# Altium schematic sheet Analog Front End.SchDoc
size A; SheetNumber: 2; SheetTotal: 5
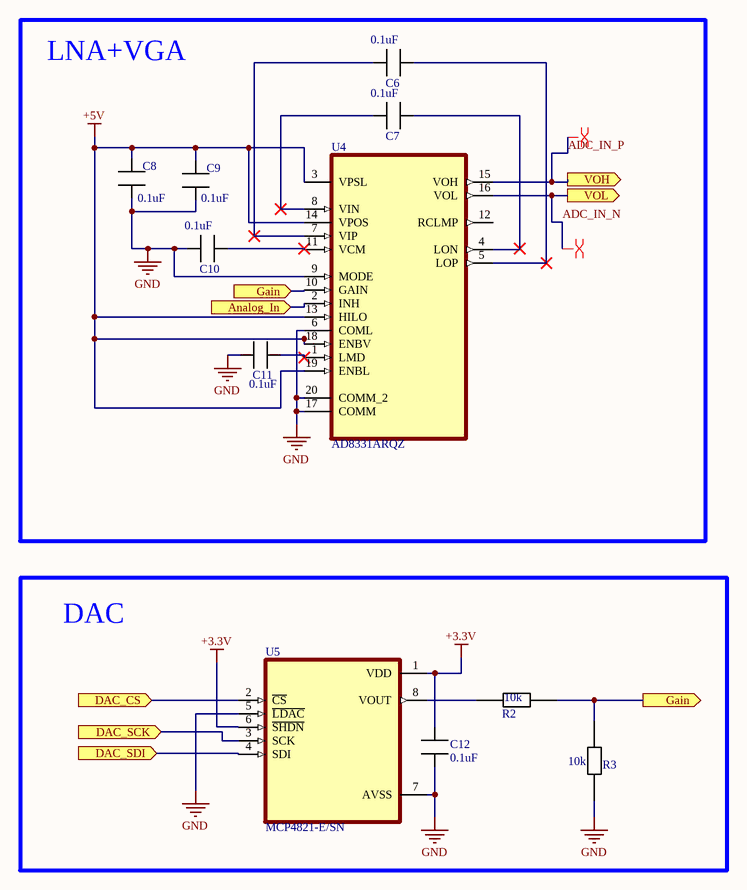
[diagram p0: Analog Front End.SchDoc]

## Parts
C6  0.1uF  [CAP_0805]
C7  0.1uF  [CAP_0805]
C8  0.1uF  [CAP_0805]
C9  0.1uF  [CAP_0805]
C10  0.1uF  [CAP_0805]
C11  0.1uF  [CAP_0805]
C12  0.1uF  [CAP_0805]
R2  10k  [RES_0805]
R3  10k  [RES_0805]
U4  AD8331ARQZ  [SOP64P600X165-20N]
U5  MCP4821-E/SN  [SOIC127P600X175-8N]

## Blocks framed on the sheet
LNA+VGA: C6-C11 U4
DAC: C12 R2 R3 U5

## Ports
Analog_In (in), DAC_CS (in), DAC_SCK (in), DAC_SDI (in), Gain (in), Gain (out), VOH (out), VOL (out)

## Nets
+3.3V: C12.2 U5.1(VDD) U5.6(~{SHDN})
+5V: C8.2 C9.2 U4.3(VPSL) U4.13(HILO) U4.14(VPOS) U4.18(ENBV) U4.19(ENBL)
GND: C8.1 C9.1 C10.1 C11.1 C12.1 R3.1 U4.6(COML) U4.9(MODE) U4.17(COMM) U4.20(COMM_2) U5.5(~{LDAC}) U5.7(AVSS)
ADC_IN_N: U4.16(VOL) ; port VOL
ADC_IN_P: U4.15(VOH) ; port VOH
Analog_In: U4.2(INH) ; port Analog_In
DAC_CS: U5.2(~{CS}) ; port DAC_CS
DAC_SCK: U5.3(SCK) ; port DAC_SCK
DAC_SDI: U5.4(SDI) ; port DAC_SDI
Gain: R2.2 R3.2 U4.10(GAIN) ; port Gain
NetC6_1: C6.1 U4.7(VIP)
NetC6_2: C6.2 U4.5(LOP)
NetC7_1: C7.1 U4.8(VIN)
NetC7_2: C7.2 U4.4(LON)
NetC10_2: C10.2 U4.11(VCM)
NetC11_2: C11.2 U4.1(LMD)
NetR2_1: R2.1 U5.8(VOUT)

Not connected (* = marked no-connect by the designer): U4 12(RCLMP)

## Layout directives
differential pair: ADC_IN_N, ADC_IN_P

## Library data of the parts
C6-C12 = CAP_0805: note: any manufacturer; val: 0.1uF
R2 R3 = RES_0805: note: any manufacturer; val: 10k
U4 = AD8331ARQZ: Single VGA with Ultralow Noise Preamplifier and Programmable RIN; MF: Analog Devices; SnapEDA_Link: https://www.snapeda.com/parts/AD8331ARQZ/Analog+Devices/view-part/?ref=snap; Package: QSOP-20 Analog Devices; Value: *; MP: AD8331ARQZ; Check_prices: https://www.snapeda.com/parts/AD8331ARQZ/Analog+Devices/view-part/?ref=eda
U5 = MCP4821-E/SN: SINGLE 12-BIT DAC WITH SPI INTERACE AND INTERNAL VREF, SOIC-8 | Microchip Technology Inc. MCP4821-E/SN; SnapEDA_Link: https://www.snapeda.com/parts/MCP4821-E/SN/Microchip+Technology/view-part/?ref=snap; Package: SOIC-8 Microchip; Value: *; MF: Microchip; MP: MCP4821-E/SN; Check_prices: https://www.snapeda.com/parts/MCP4821-E/SN/Microchip+Technology/view-part/?ref=eda